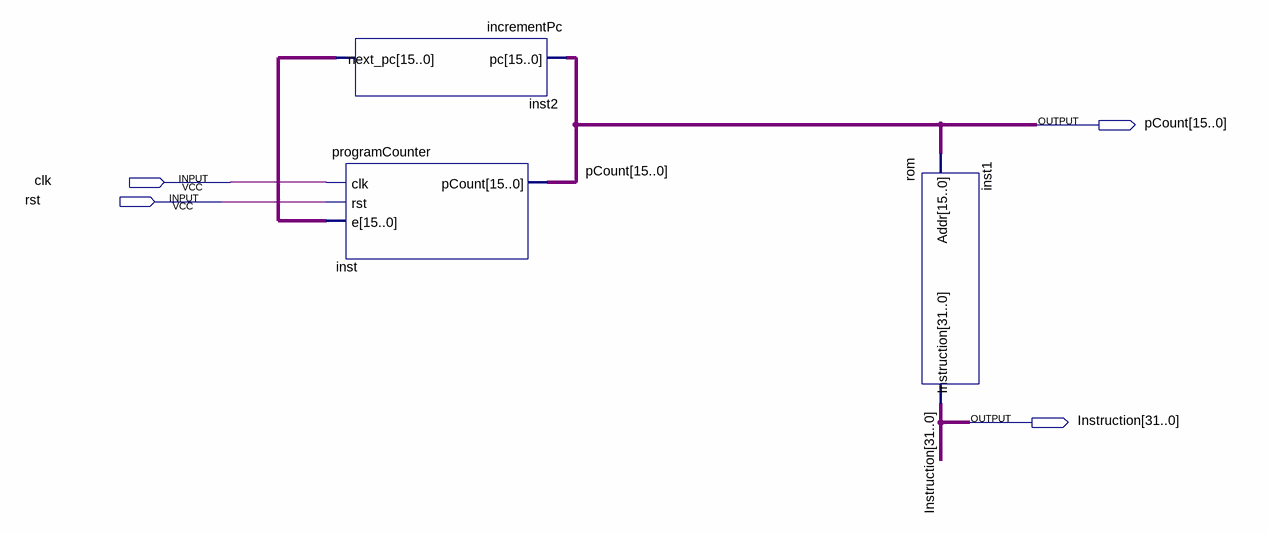
[diagram p0: schematic sheet]
// Quartus schematic pcTest.bdf as structural Verilog: 3 symbols, 4 pins
module pcTest (
  input  clk,
  input  rst,
  output [15:0] pCount,
  output [31:0] Instruction
);

  wire [15:0] inst2_next_pc;

  incrementPc inst2 (.pc(pCount), .next_pc(inst2_next_pc));
  programCounter inst (.clk(clk), .rst(rst), .e(inst2_next_pc), .pCount(pCount));
  rom inst1 (.Addr(pCount), .Instruction(Instruction));
endmodule
